# EAGLE schematic rpi-ds17b20 (EAGLE 9.5.2)
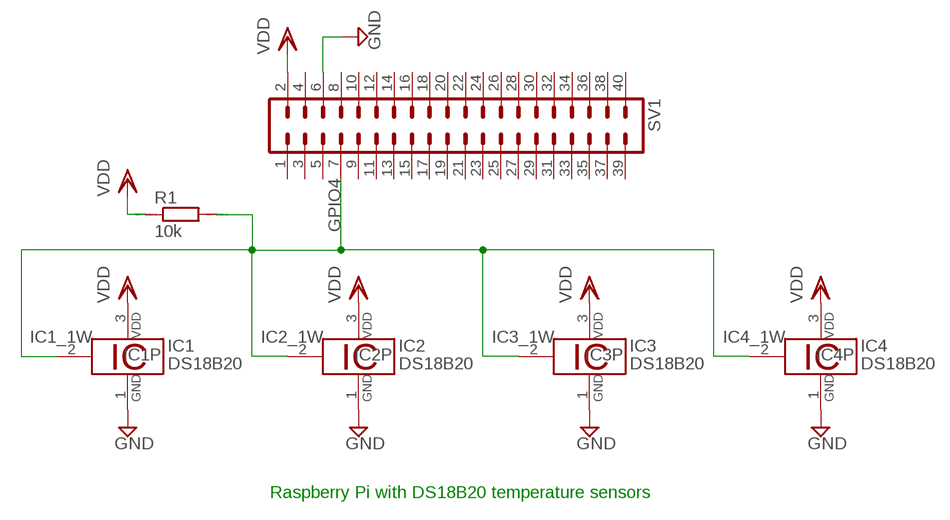
[diagram p0: schematic, sheet 1]

## Parts
IC1  DS18B20  [TO92-]
IC2  DS18B20  [TO92-]
IC3  DS18B20  [TO92-]
IC4  DS18B20  [TO92-]
R1  10k  R0204/7  [0204/7]
SV1  MA20-2  [MA20-2]

## Nets
GND: IC1.1 IC2.1 IC3.1 IC4.1 SV1.6
GPIO4: IC1.2 IC2.2 IC3.2 IC4.2 R1.2 SV1.7
VDD: IC1.3 IC2.3 IC3.3 IC4.3 R1.1 SV1.2
Unconnected: SV1.1 SV1.3 SV1.4 SV1.5 SV1.8 SV1.9 SV1.10 SV1.11 SV1.12 SV1.13 SV1.14 SV1.15 SV1.16 SV1.17 SV1.18 SV1.19 SV1.20 SV1.21 SV1.22 SV1.23 SV1.24 SV1.25 SV1.26 SV1.27 SV1.28 SV1.29 SV1.30 SV1.31 SV1.32 SV1.33 SV1.34 SV1.35 SV1.36 SV1.37 SV1.38 SV1.39 SV1.40

## Notes on the sheet
- Raspberry Pi with DS18B20 temperature sensors

## Library data of the parts
IC1-IC4 = 1wire:DS18B20: Programmable Resolution Digital Thermometer This chip provides a onewire thermosensor with approx. 0.5°C accuracy. A programmable over/undertemperure alarm is available. The precision can be set from 9..12 bits. Notes: Vdd must be applied for accurate measurements at low temperatures, as the parasite power circuit otherwise heats the sensor. If parasite power is used, Vdd has to be connected to GND. The DS1822 is a low-cost thermometer chip, the DS18S20 is similar to the DS18B20, but with 9 Bit precision only. Author: Jan Kandziora <jjj@gmx.de>
R1 = eagle-ltspice:R: RESISTOR, European symbol; SPICEMODEL: NONE; SPICEPREFIX: R
SV1 = con-lstb:MA20-2: PIN HEADER; OC_FARNELL: unknown; OC_NEWARK: unknown